# Altium schematic sheet RF.SchDoc
size A3
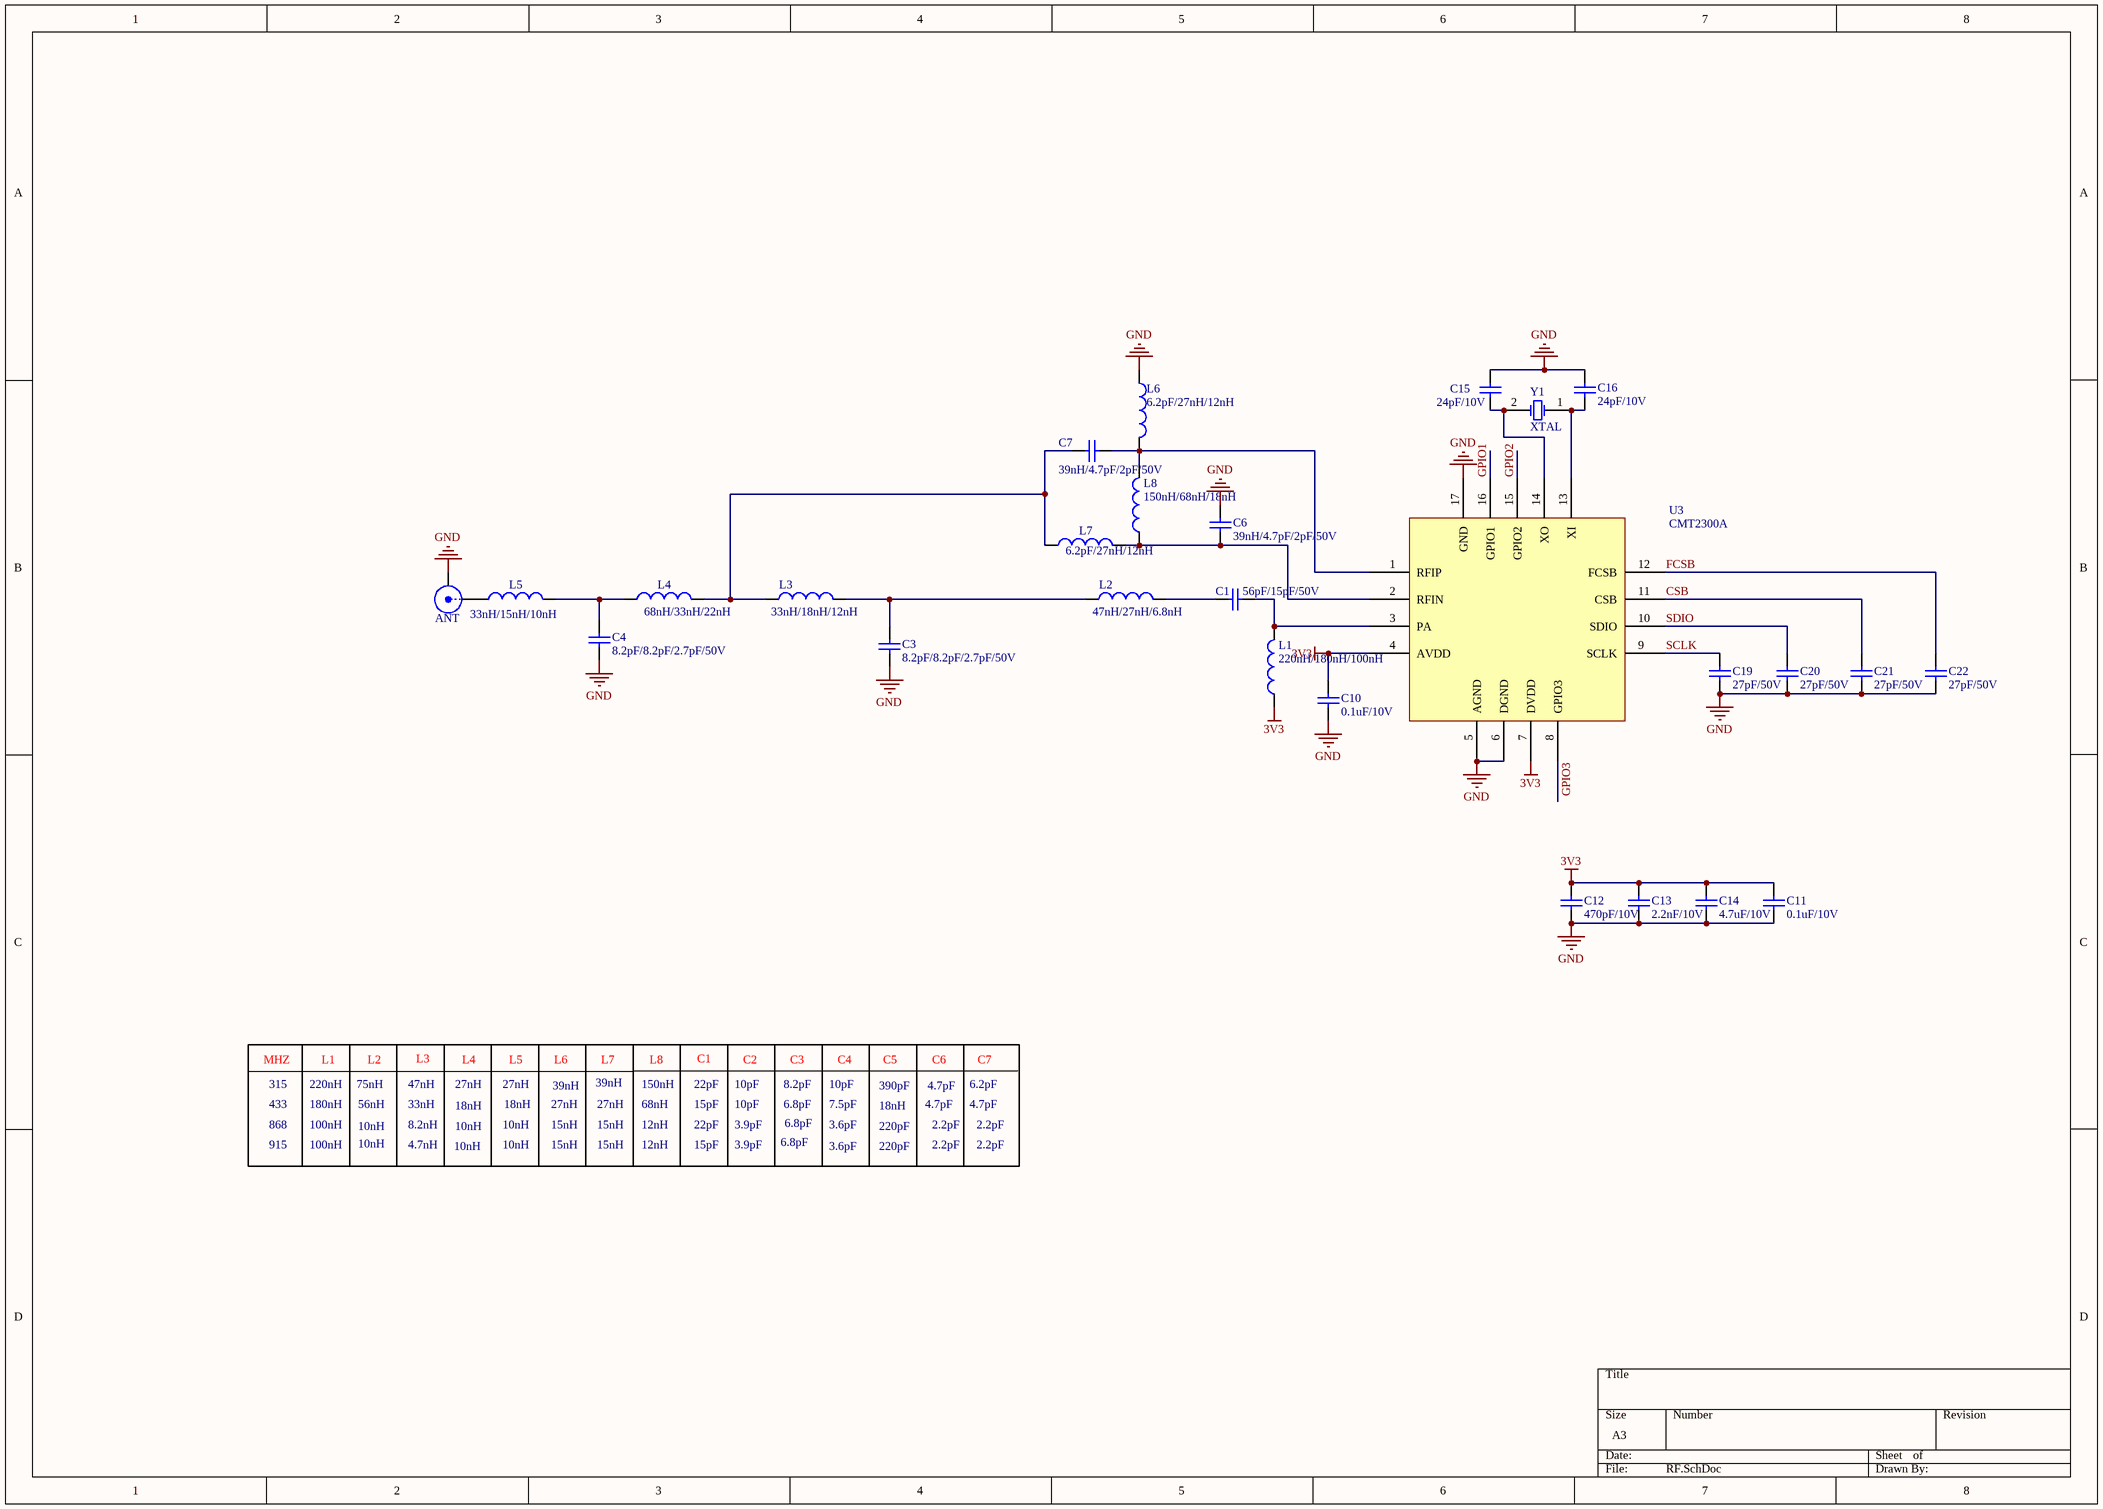
[diagram p0: RF.SchDoc]

## Parts
ANT  (no value)  [SMA Straight SMD]
C1  56pF/15pF/50V  [0603C]
C3  8.2pF/8.2pF/2.7pF/50V  [0603C]
C4  8.2pF/8.2pF/2.7pF/50V  [0603C]
C6  39nH/4.7pF/2pF/50V  [0603C]
C7  39nH/4.7pF/2pF/50V  [0603C]
C10  0.1uF/10V  [0603C]
C11  0.1uF/10V  [0603C]
C12  470pF/10V  [0603C]
C13  2.2nF/10V  [0603C]
C14  4.7uF/10V  [0603C]
C15  24pF/10V  [0603C]
C16  24pF/10V  [0603C]
C19  27pF/50V  [0603C]
C20  27pF/50V  [0603C]
C21  27pF/50V  [0603C]
C22  27pF/50V  [0603C]
L1  220nH/180nH/100nH  [0603R]
L2  47nH/27nH/6.8nH  [0603R]
L3  33nH/18nH/12nH  [0603R]
L4  68nH/33nH/22nH  [0603R]
L5  33nH/15nH/10nH  [0603R]
L6  6.2pF/27nH/12nH  [0603R]
L7  6.2pF/27nH/12nH  [0603R]
L8  150nH/68nH/18nH  [0603R]
U3  CMT2300A
Y1  XTAL  [BCY-W2/D3.1]

## Nets
3V3: C10.1 C11.1 C12.1 C13.1 C14.1 L1.1 U3.4(AVDD) U3.7(DVDD)
GND: ANT.2(GND) C3.2 C4.2 C6.2 C10.2 C11.2 C12.2 C13.2 C14.2 C15.1 C16.1 C19.2 C20.2 C21.2 C22.2 L6.1 U3.5(AGND) U3.6(DGND) U3.17(GND)
CSB: C21.1 U3.11(CSB)
FCSB: C22.1 U3.12(FCSB)
GPIO1: U3.16(GPIO1)
GPIO2: U3.15(GPIO2)
GPIO3: U3.8(GPIO3)
SCLK: C19.1 U3.9(SCLK)
SDIO: C20.1 U3.10(SDIO)
NetANT_1: ANT.1(Signal) L5.1
NetC1_1: C1.1 L2.2
NetC1_2: C1.2 L1.2 U3.3(PA)
NetC3_1: C3.1 L2.1 L3.2
NetC4_1: C4.1 L4.1 L5.2
NetC6_1: C6.1 L7.2 L8.1 U3.2(RFIN)
NetC7_1: C7.1 L3.1 L4.2 L7.1
NetC7_2: C7.2 L6.2 L8.2 U3.1(RFIP)
NetC15_2: C15.2 U3.14(XO) Y1.2(OSC2)
NetC16_2: C16.2 U3.13(XI) Y1.1(OSC1)

## Notes on the sheet
- MHZ
- 315
- 433
- 868
- 220nH
- 180nH
- 100nH
- L1
- 75nH
- 56nH
- L2
- 47nH
- 33nH
- 8.2nH
- L3
- 27nH
- 18nH
- L4
- 10nH
- L5
- 15nH
- 39nH
- L6
- L7
- 150nH
- 68nH
- 12nH
- L8
- 22pF
- 15pF
- C1
- 10pF
- 3.9pF
- C2
- 8.2pF
- 6.8pF
- C3
- 7.5pF
- 3.6pF
- C4
- 390pF
- C5
- 4.7pF
- C6
- 2.2pF
- 6.2pF
- C7
- 915
- 4.7nH
- 220pF

## Library data of the parts
ANT = SMA: SMA Straight Connector; LatestRevisionDate: 05-oct-2007  -  Semtech; LatestRevisionNote: Re-released for DXP Platform.; Publisher: Altium Limited
C1 C3 C4 C6 C7 C10-C16 C19-C22 = Cap: Capacitor; Value: 106; Published: 8-Jun-2000; LatestRevisionDate: 17-Jul-2002; LatestRevisionNote: Re-released for DXP Platform.; PackageReference: RAD-0.3; Publisher: Altium Limited
L1-L8 = Inductor: Code_IEC: 1005; Value: 10mH; Published: 8-Jun-2000; LatestRevisionDate: 29-May-2009; LatestRevisionNote: IPC-7351 Footprint Added.; PackageReference: 0402-A; Publisher: Altium Limited; PackageDescription: Chip Inductor; Code_JEITA: 0402
Y1 = XTAL: Crystal Oscillator; Published: 8-Jun-2000; LatestRevisionDate: 17-Jul-2002; LatestRevisionNote: Re-released for DXP Platform.; PackageReference: R38; Publisher: Altium Limited